# EAGLE design untitled (EAGLE 6.5.0)
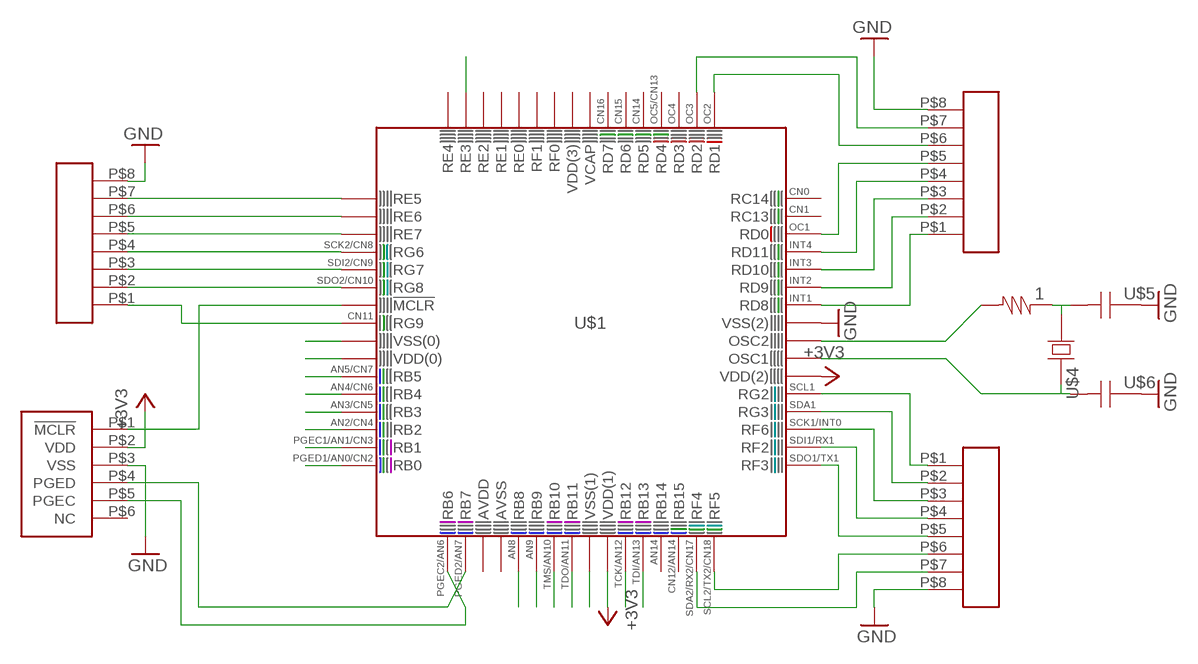
[diagram p0: schematic, sheet 1]

## Parts
1  .RES-0603  [E_0603]
U$1  PIC32MX5XX  [E_QFN64]
U$2  CON_8PIN  [CON_8PIN]
U$3  CON_8PIN  [CON_8PIN]
U$4  .XTAL-CTS406  [SMT_CRYSTAL]
U$5  .CAP-0603  [E_0603]
U$6  .CAP-0603  [E_0603]
U$27  CON_8PIN  [CON_8PIN]
U$29  CON_ICSP-PIC  [CON_ICSP-PIC]

## Nets
+3V3: U$1.P$26(VDD(1)) U$1.P$38(VDD(2)) U$29.P$2(VDD)
GND: U$1.P$41(VSS(2)) U$2.P$8 U$3.P$8 U$5.P$2 U$6.P$2 U$27.P$8 U$29.P$3(VSS)
N$1: U$1.P$37(RG2) U$27.P$1
N$2: U$1.P$36(RG3) U$27.P$2
N$3: U$1.P$35(RF6) U$27.P$3
N$4: U$1.P$42(RD8) U$3.P$1
N$5: U$1.P$18(RB7) U$29.P$4(PGED)
N$6: U$1.P$6(RG8) U$2.P$2
N$7: U$1.P$5(RG7) U$2.P$3
N$8: U$1.P$43(RD9) U$3.P$2
N$9: U$1.P$44(RD10) U$3.P$3
N$10: U$1.P$34(RF2) U$27.P$4
N$11: U$1.P$33(RF3) U$27.P$5
N$12: U$1.P$32(RF5) U$27.P$6
N$13: U$1.P$4(RG6) U$2.P$4
N$14: U$1.P$3(RE7) U$2.P$5
N$15: U$1.P$49(RD1) U$3.P$6
N$16: U$1.P$50(RD2) U$3.P$7
N$17: U$1.P$9(VSS(0))
N$18: U$1.P$31(RF4) U$27.P$7
N$19: U$1.P$45(RD11) U$3.P$4
N$20: U$1.P$46(RD0) U$3.P$5
N$21: U$1.P$10(VDD(0))
N$22: U$1.P$17(RB6) U$29.P$5(PGEC)
N$23: U$1.P$11(RB5)
N$24: U$1.P$7(!MCLR) U$29.P$1(!MCLR)
N$25: U$1.P$2(RE6) U$2.P$6
N$26: U$1.P$1(RE5) U$2.P$7
N$27: U$1.P$12(RB4)
N$28: U$1.P$13(RB3)
N$29: U$1.P$14(RB2)
N$30: U$1.P$15(RB1)
N$31: U$1.P$16(RB0)
N$32: U$1.P$21(RB8)
N$33: U$1.P$22(RB9)
N$34: U$1.P$23(RB10)
N$35: U$1.P$24(RB11)
N$36: U$1.P$25(VSS(1))
N$38: U$1.P$27(RB12)
N$39: U$1.P$28(RB13)
N$40: 1.P$1 U$1.P$40(OSC2)
N$42: 1.P$2 U$4.P$1 U$5.P$1
N$43: U$1.P$39(OSC1) U$4.P$3 U$6.P$1
N$46: U$1.P$63(RE3)
N$48: U$1.P$8(RG9) U$2.P$1
Unconnected: U$1.P$19(AVDD) U$1.P$20(AVSS) U$1.P$29(RB14) U$1.P$30(RB15) U$1.P$47(RC13) U$1.P$48(RC14) U$1.P$51(RD3) U$1.P$52(RD4) U$1.P$53(RD5) U$1.P$54(RD6) U$1.P$55(RD7) U$1.P$56(VCAP) U$1.P$57(VDD(3)) U$1.P$58(RF0) U$1.P$59(RF1) U$1.P$60(RE0) U$1.P$61(RE1) U$1.P$62(RE2) U$1.P$64(RE4) U$29.P$6(NC)

## Library data of the parts
1 = evan:.RES
U$1 = evan:PIC32MX5XX
U$2 U$3 U$27 = evan:CON_8PIN
U$4 = evan:.XTAL
U$5 U$6 = evan:.CAP
U$29 = evan:CON_ICSP-PIC

## Board
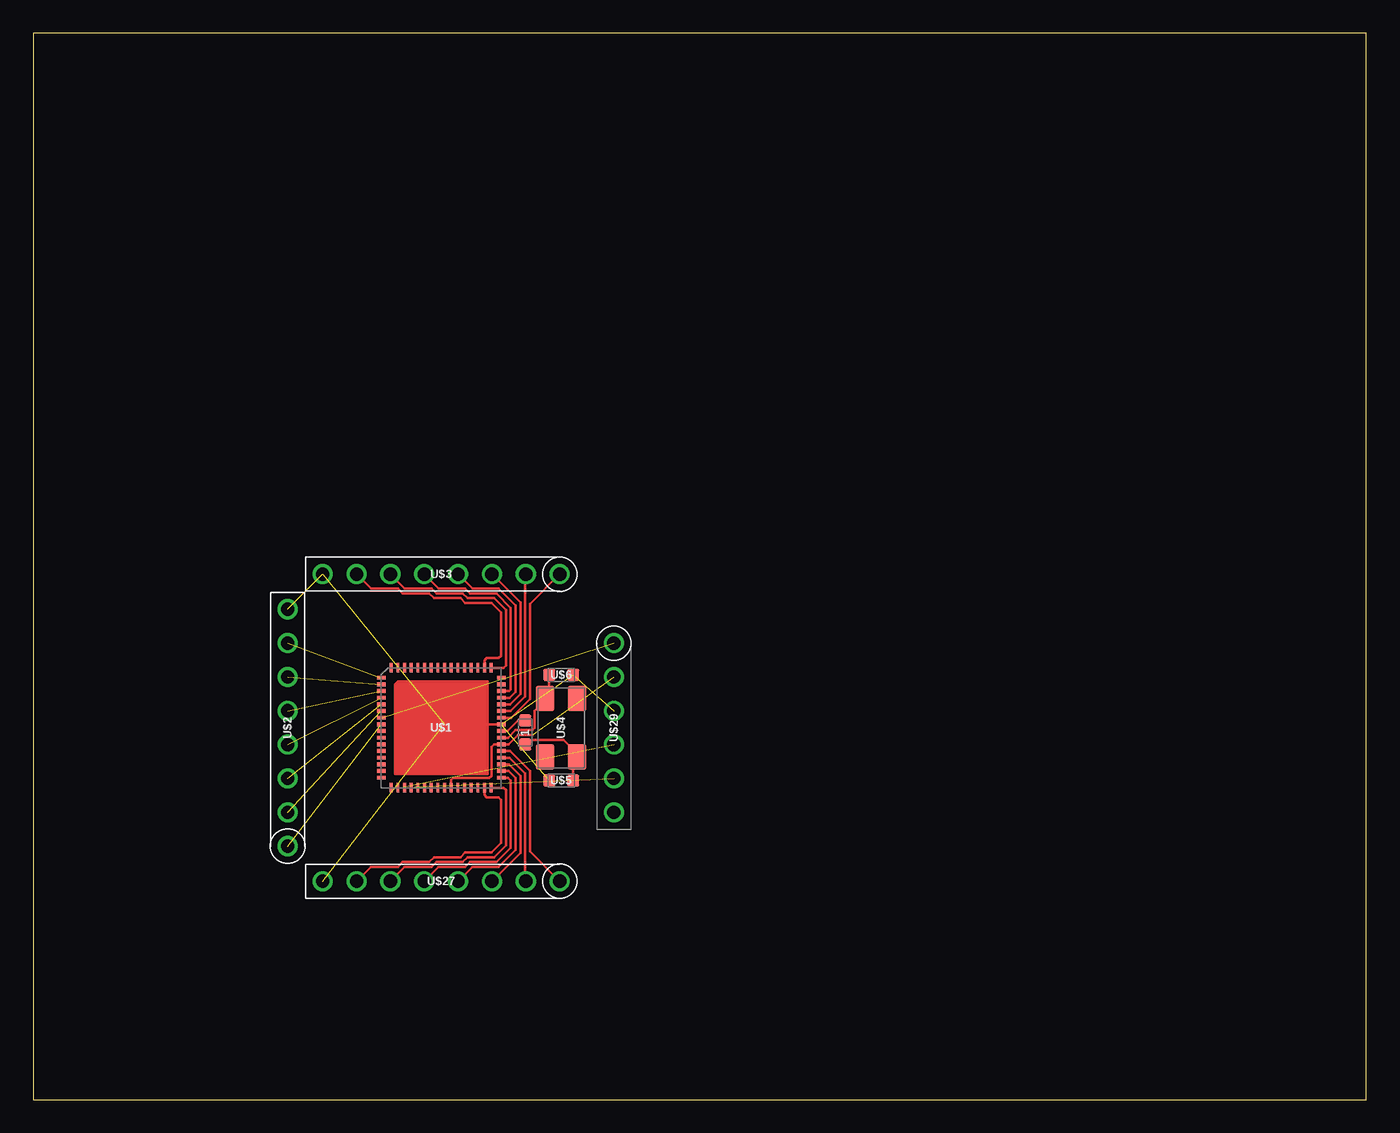
[diagram p1: board, top side]

Size 100 x 80 mm. Coordinates in mm from the lower left corner, seen from the top.
Outline: 0,0 100,0 100,80 0,80 0,0
Copper layers (1*16): Top 0.035mm / dielectric 1.5mm / Bottom 0.035mm
Design rules "default": minimum track width 10mil, minimum drill 24mil, track to track 8mil, track to pad 8mil, pad to pad 8mil, via to via 8mil, smd to smd 8mil, copper to edge 40mil, drill to drill 8mil, minimum pad ring 10mil, minimum via ring 8mil, stop-mask expansion 4mil, vias tented up to drill 0mil, thermal gap 10mil

### Footprints (pad centres in the part's own frame; a part is rotated, then mirrored left to right if it is on the bottom)
E_0603 = smd 0.9 x 0.9: P$1 -0.9,0; P$2 0.9,0
E_QFN64 = smd 0.7 x 0.28: P$1 -4.5,3.75; P$2 -4.5,3.25; P$3 -4.5,2.75; P$4 -4.5,2.25; P$5 -4.5,1.75; P$6 -4.5,1.25; P$7 -4.5,0.75; P$8 -4.5,0.25; P$9 -4.5,-0.25; P$10 -4.5,-0.75; P$11 -4.5,-1.25; P$12 -4.5,-1.75; P$13 -4.5,-2.25; P$14 -4.5,-2.75; P$15 -4.5,-3.25; P$16 -4.5,-3.75; P$33 4.5,-3.75; P$34 4.5,-3.25; P$35 4.5,-2.75; P$36 4.5,-2.25; P$37 4.5,-1.75; P$38 4.5,-1.25; P$39 4.5,-0.75; P$40 4.5,-0.25; P$41 4.5,0.25; P$42 4.5,0.75; P$43 4.5,1.25; P$44 4.5,1.75; P$45 4.5,2.25; P$46 4.5,2.75; P$47 4.5,3.25; P$48 4.5,3.75 | smd 0.28 x 0.7: P$17 -3.75,-4.5; P$18 -3.25,-4.5; P$19 -2.75,-4.5; P$20 -2.25,-4.5; P$21 -1.75,-4.5; P$22 -1.25,-4.5; P$23 -0.75,-4.5; P$24 -0.25,-4.5; P$25 0.25,-4.5; P$26 0.75,-4.5; P$27 1.25,-4.5; P$28 1.75,-4.5; P$29 2.25,-4.5; P$30 2.75,-4.5; P$31 3.25,-4.5; P$32 3.75,-4.5; P$49 3.75,4.5; P$50 3.25,4.5; P$51 2.75,4.5; P$52 2.25,4.5; P$53 1.75,4.5; P$54 1.25,4.5; P$55 0.75,4.5; P$56 0.25,4.5; P$57 -0.25,4.5; P$58 -0.75,4.5; P$59 -1.25,4.5; P$60 -1.75,4.5; P$61 -2.25,4.5; P$62 -2.75,4.5; P$63 -3.25,4.5; P$64 -3.75,4.5
CON_8PIN = drill 1: P$1 -8.89,0; P$2 -6.35,0; P$3 -3.81,0; P$4 -1.27,0; P$5 1.27,0; P$6 3.81,0; P$7 6.35,0; P$8 8.89,0
SMT_CRYSTAL = smd 1.9 x 1.4: P$1 -2.2,-1.2; P$2 2.2,-1.2; P$3 2.2,1.2; P$4 -2.2,1.2
CON_ICSP-PIC = drill 1: P$1 -6.35,0; P$2 -3.81,0; P$3 -1.27,0; P$4 1.27,0; P$5 3.81,0; P$6 6.35,0

### Placement (x,y rotation side)
1  36.9,27.54 270 top
U$1  30.6,27.9 0 top
U$2  19.08,27.9 90 top
U$3  30.6,39.42 180 top
U$4  39.6,27.9 90 top
U$5  39.6,23.94 180 top
U$6  39.6,31.86 0 top
U$27  30.6,16.38 180 top
U$29  43.56,27.9 270 top

### Tracks (layer width: path | path; a pad name or v marks a point on that pad's centre or on a via)
+3V3  (1 unrouted)
  Top 0.178: 37.44,27.36 36.36,27.36 35.65,26.65 U$1.P$38 34.57,26.65 34.38,26.46 34.38,24.3 34.2,24.12 31.5,24.12 31.35,23.97 U$1.P$26
GND  (6 unrouted)
  Top 0.178: U$1.P$41 30.85,28.15 30.6,27.9
N$1
  Top 0.178: U$1.P$37 35.77,26.15 37.26,24.66 37.26,18.61 U$27.P$1
N$2
  Top 0.178: U$1.P$36 35.73,25.65 36.9,24.48 36.9,16.43 U$27.P$2
N$3
  Top 0.178: U$1.P$35 35.69,25.15 36.54,24.3 36.54,18.51 U$27.P$3
N$4
  Top 0.178: U$1.P$42 35.85,28.65 37.26,30.06 37.26,37.19 U$3.P$1
N$5  (1 unrouted)
N$6  (1 unrouted)
N$7  (1 unrouted)
N$8
  Top 0.178: U$1.P$43 35.81,29.15 36.9,30.24 36.9,39.37 U$3.P$2
N$9
  Top 0.178: U$1.P$44 35.77,29.65 36.54,30.42 36.54,37.29 U$3.P$3
N$10
  Top 0.178: U$1.P$34 35.65,24.65 36.18,24.12 36.18,18.72 34.92,17.46 32.95,17.46 U$27.P$4
N$11
  Top 0.178: U$1.P$33 35.61,24.15 35.82,23.94 35.82,18.9 34.74,17.82 32.76,17.82 32.4,17.46 30.41,17.46 U$27.P$5
N$12
  Top 0.178: U$1.P$32 35.28,23.4 35.46,23.22 35.46,19.08 34.56,18.18 32.58,18.18 32.22,17.82 30.24,17.82 29.88,17.46 27.87,17.46 U$27.P$6
N$13  (1 unrouted)
N$14  (1 unrouted)
N$15
  Top 0.178: U$1.P$49 35.28,32.4 35.46,32.58 35.46,36.72 34.56,37.62 32.58,37.62 32.22,37.98 30.24,37.98 29.88,38.34 27.87,38.34 U$3.P$6
N$16
  Top 0.178: U$1.P$50 33.85,32.95 34.02,33.12 34.92,33.12 35.1,33.3 35.1,36.54 34.38,37.26 32.4,37.26 32.04,37.62 30.06,37.62 29.7,37.98 27.72,37.98 27.36,38.34 25.33,38.34 U$3.P$7
N$18
  Top 0.178: U$1.P$31 33.85,22.85 34.02,22.68 34.92,22.68 35.1,22.5 35.1,19.26 34.38,18.54 32.4,18.54 32.04,18.18 30.06,18.18 29.7,17.82 27.72,17.82 27.36,17.46 25.33,17.46 U$27.P$7
N$19
  Top 0.178: U$1.P$45 35.73,30.15 36.18,30.6 36.18,37.08 34.92,38.34 32.95,38.34 U$3.P$4
N$20
  Top 0.178: U$1.P$46 35.69,30.65 35.82,30.78 35.82,36.9 34.74,37.98 32.76,37.98 32.4,38.34 30.41,38.34 U$3.P$5
N$22  (1 unrouted)
N$24  (1 unrouted)
N$25  (1 unrouted)
N$26  (1 unrouted)
N$40
  Top 0.178: U$1.P$40 35.57,27.65 36.36,28.44 1.P$1
N$42
  Top 0.178: 1.P$2 37.08,26.64 37.44,27 39.78,27 40.5,26.28 40.5,26 | 40.5,26 U$4.P$1 | 40.5,26 U$5.P$1
N$43
  Top 0.178: U$1.P$39 35.61,27.15 36.18,27.72 37.44,27.72 37.62,27.9 37.62,29.16 37.8,29.34 37.8,29.5 U$4.P$3 38.7,30.4 U$6.P$1
N$48  (1 unrouted)